# Altium schematic sheet BRK7010.SchDoc: BRK7010
size C; Organization: Opal Kelly; Address1: 13500 SW 72nd Ave, STE 100; Address2: Portland, OR 97223; Address4: http://www.opalkelly.com; DocumentNumber: xxx; Revision: 1; SheetNumber: 1; SheetTotal: 1; PageSetup: Record=PageOptions|CenterHorizontal=True|CenterVertical=True|PrintScale=0.54|XCorrection=1.00|YCorrection=1.00|PrintKind=0|BorderSize=5000000|LeftOffset=0|BottomOffset=0|Orientation=2|PaperLength=1000|PaperWidth=1000|Scale=100|PaperSource=7|PrintQuality=-4|MediaType=1|DitherType=10|PaperKind=Letter|PrintScaleMode=1
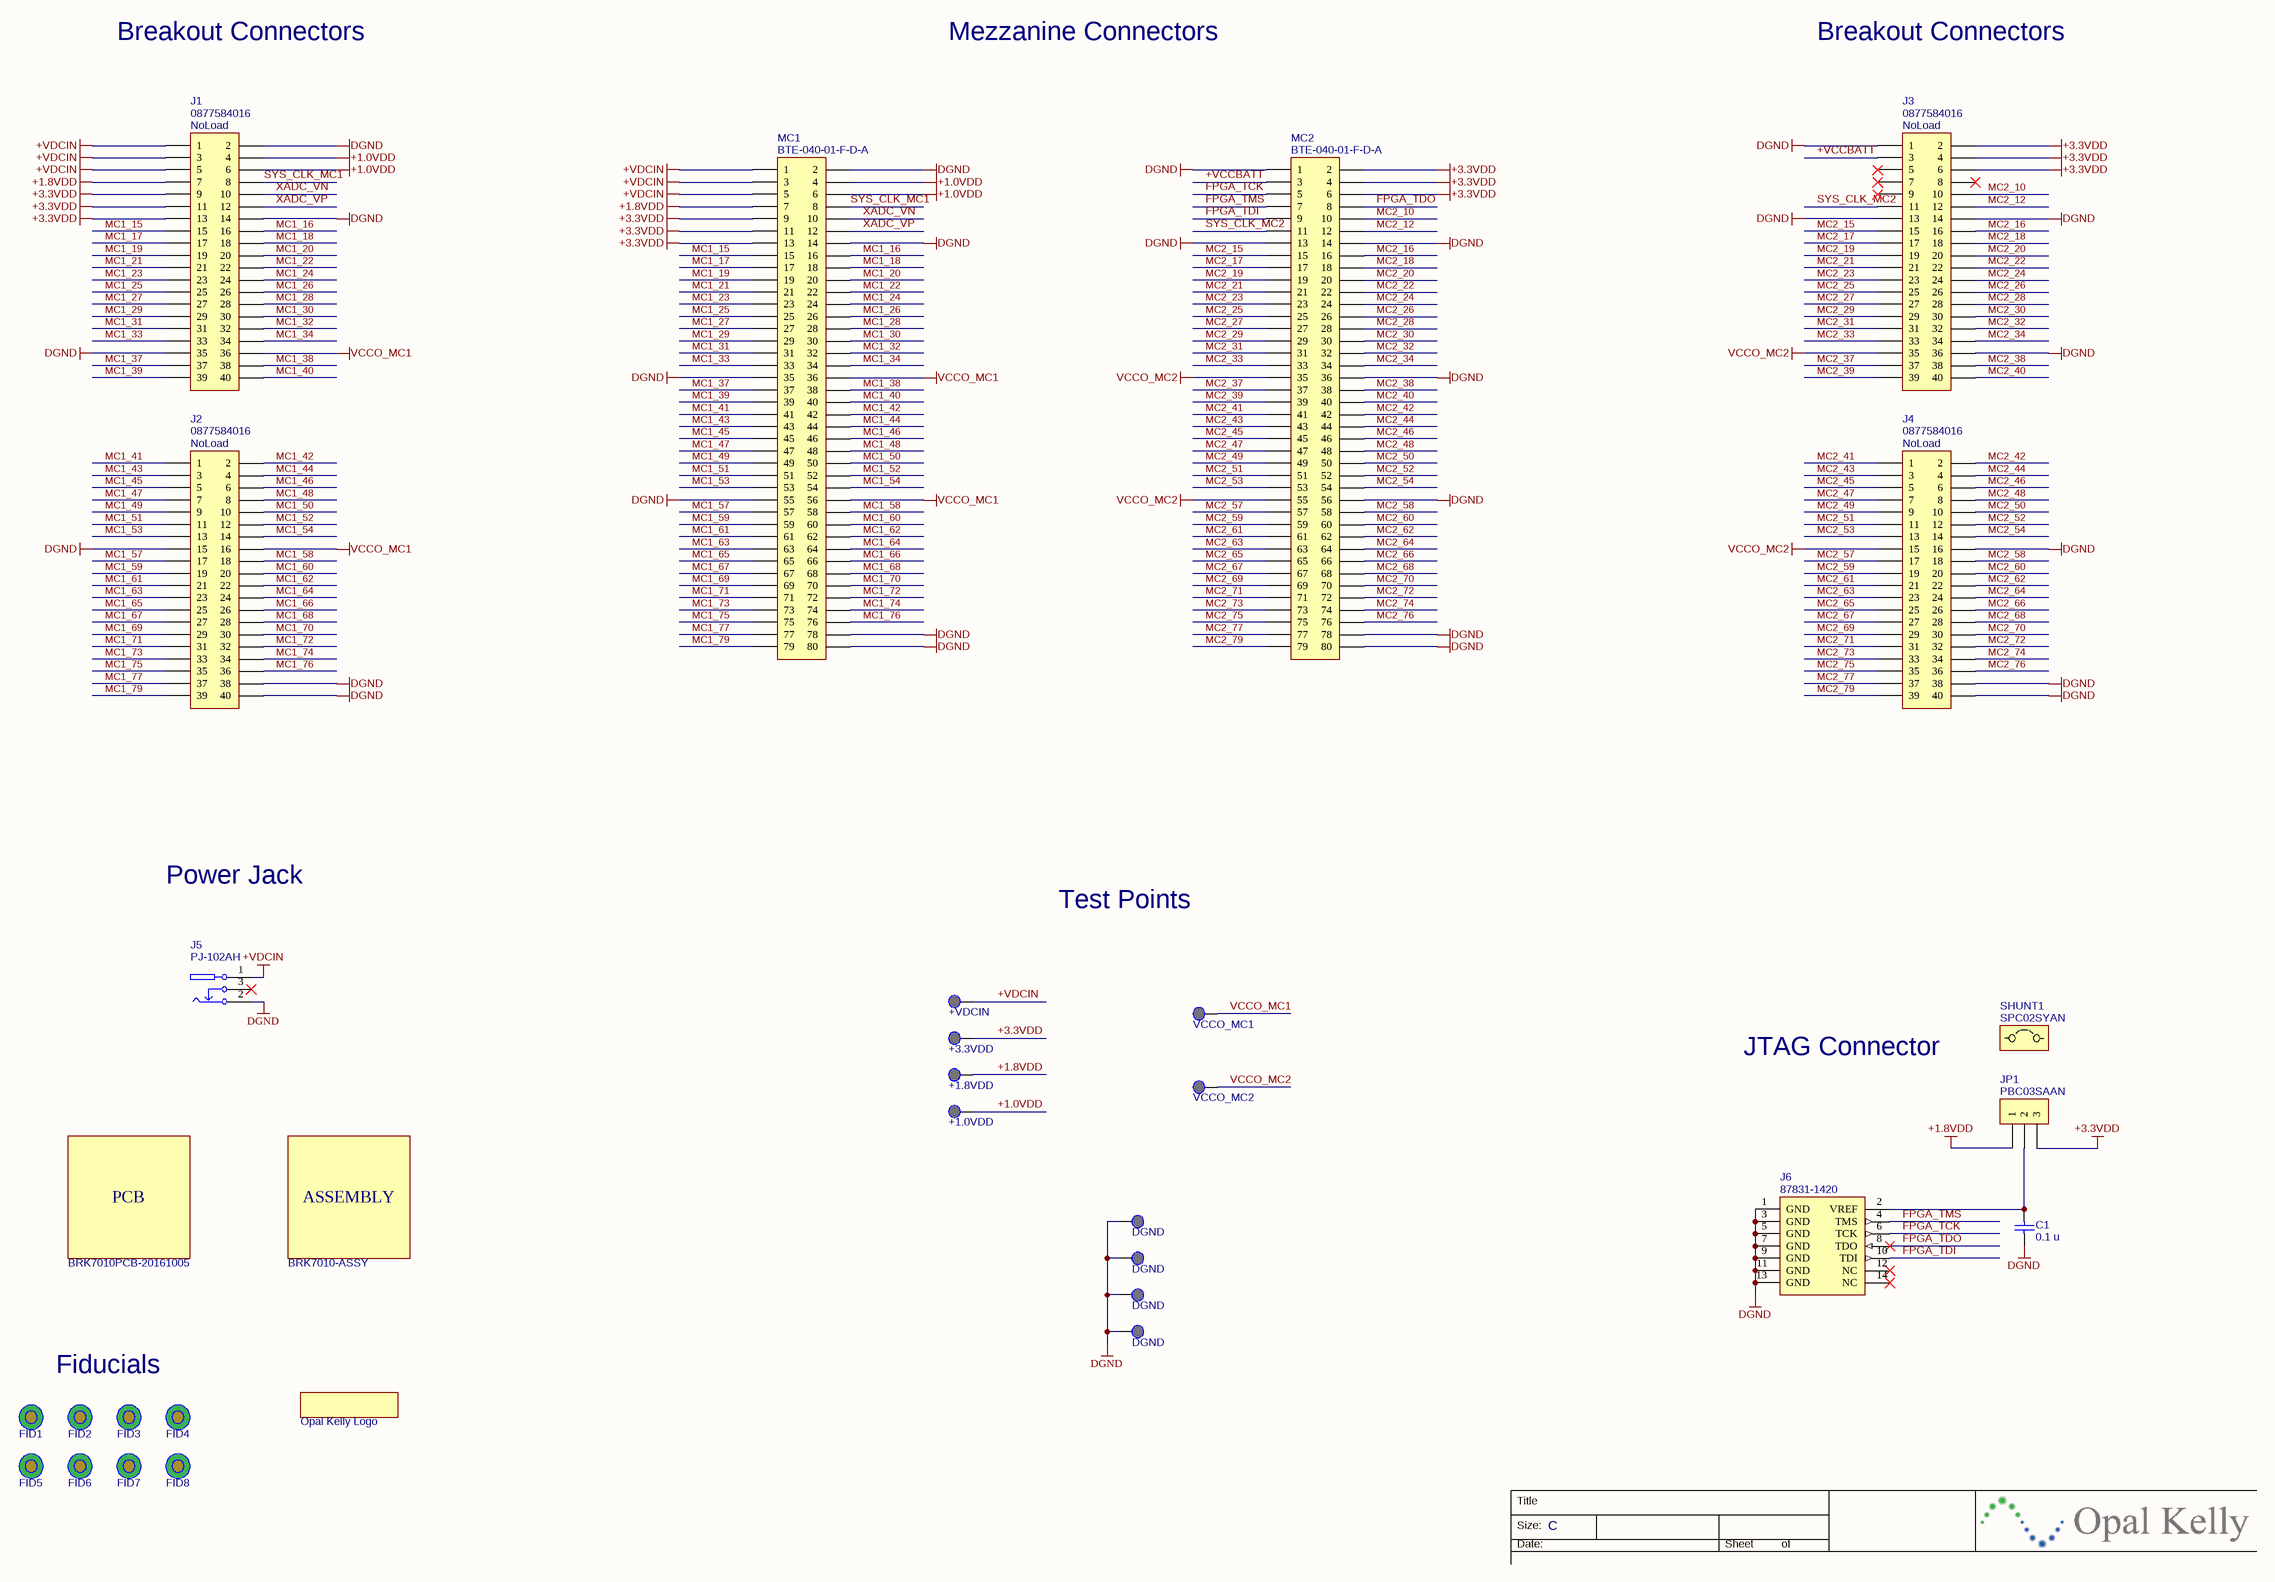
[diagram p0: BRK7010.SchDoc]

## Parts
*1  Opal Kelly Logo  [okLogo-23x5]
ASSY1  BRK7010-ASSY  (mechanical)
C1  value 0.1 u  [CAPC1608N]  (hidden comment: C0603C104K4RACTU)
FID1  FIDUCIAL  [FID1MM/2MM-SS]  (value not drawn)
FID2  FIDUCIAL  [FID1MM/2MM-SS]  (value not drawn)
FID3  FIDUCIAL  [FID1MM/2MM-SS]  (value not drawn)
FID4  FIDUCIAL  [FID1MM/2MM-SS]  (value not drawn)
FID5  FIDUCIAL  [FID1MM/2MM-SS]  (value not drawn)
FID6  FIDUCIAL  [FID1MM/2MM-SS]  (value not drawn)
FID7  FIDUCIAL  [FID1MM/2MM-SS]  (value not drawn)
FID8  FIDUCIAL  [FID1MM/2MM-SS]  (value not drawn)
J1  0877584016  [HDR2X20-2MM]
J2  0877584016  [HDR2X20-2MM]
J3  0877584016  [HDR2X20-2MM]
J4  0877584016  [HDR2X20-2MM]
J5  PJ-102AH  [CUI-PJ102A]
J6  87831-1420  [HDR2X7-2MM]
JP1  PBC03SAAN  [HDR1X3]
MC1  BTE-040-01-F-D-A  [BTE-040]
MC2  BTE-040-01-F-D-A  [BTE-040]
PCB1  BRK7010PCB-20161005  (mechanical)
SHUNT1  SPC02SYAN  (mechanical)
TP1  +VDCIN  [TP-PTH-65/100]
TP2  VCCO_MC1  [TP-PTH-65/100]
TP3  +3.3VDD  [TP-PTH-65/100]
TP4  +1.8VDD  [TP-PTH-65/100]
TP5  VCCO_MC2  [TP-PTH-65/100]
TP6  +1.0VDD  [TP-PTH-65/100]
TP7  DGND  [TP-PTH-65/100]
TP8  DGND  [TP-PTH-65/100]
TP9  DGND  [TP-PTH-65/100]
TP10  DGND  [TP-PTH-65/100]

## Nets
+1.0VDD: J1.4 J1.6 MC1.4 MC1.6 TP6.1(PIN)
+1.8VDD: J1.7 JP1.1 MC1.7 TP4.1(PIN)
+3.3VDD: J1.9 J1.11 J1.13 J3.2 J3.4 J3.6 JP1.3 MC1.9 MC1.11 MC1.13 MC2.2 MC2.4 MC2.6 TP3.1(PIN)
+VDCIN: J1.1 J1.3 J1.5 J5.1 MC1.1 MC1.3 MC1.5 TP1.1(PIN)
DGND: C1.1 J1.2 J1.14 J1.35 J2.15 J2.38 J2.40 J3.1 J3.13 J3.14 J3.36 J4.16 J4.38 J4.40 J5.2 J6.1(GND) J6.3(GND) J6.5(GND) J6.7(GND) J6.9(GND) J6.11(GND) J6.13(GND) MC1.2 MC1.14 MC1.35 MC1.55 MC1.78 MC1.80 MC2.1 MC2.13 MC2.14 MC2.36 MC2.56 MC2.78 MC2.80 TP7.1(PIN) TP8.1(PIN) TP9.1(PIN) TP10.1(PIN)
VCCO_MC1: J1.36 J2.16 MC1.36 MC1.56 TP2.1(PIN)
VCCO_MC2: J3.35 J4.15 MC2.35 MC2.55 TP5.1(PIN)
+VCCBATT: J3.3 MC2.3
FPGA_TCK: J6.6(TCK) MC2.5
FPGA_TDI: J6.10(TDI) MC2.9
FPGA_TDO: J6.8(TDO) MC2.8
FPGA_TMS: J6.4(TMS) MC2.7
MC1_15: J1.15 MC1.15
MC1_16: J1.16 MC1.16
MC1_17: J1.17 MC1.17
MC1_18: J1.18 MC1.18
MC1_19: J1.19 MC1.19
MC1_20: J1.20 MC1.20
MC1_21: J1.21 MC1.21
MC1_22: J1.22 MC1.22
MC1_23: J1.23 MC1.23
MC1_24: J1.24 MC1.24
MC1_25: J1.25 MC1.25
MC1_26: J1.26 MC1.26
MC1_27: J1.27 MC1.27
MC1_28: J1.28 MC1.28
MC1_29: J1.29 MC1.29
MC1_30: J1.30 MC1.30
MC1_31: J1.31 MC1.31
MC1_32: J1.32 MC1.32
MC1_33: J1.33 MC1.33
MC1_34: J1.34 MC1.34
MC1_37: J1.37 MC1.37
MC1_38: J1.38 MC1.38
MC1_39: J1.39 MC1.39
MC1_40: J1.40 MC1.40
MC1_41: J2.1 MC1.41
MC1_42: J2.2 MC1.42
MC1_43: J2.3 MC1.43
MC1_44: J2.4 MC1.44
MC1_45: J2.5 MC1.45
MC1_46: J2.6 MC1.46
MC1_47: J2.7 MC1.47
MC1_48: J2.8 MC1.48
MC1_49: J2.9 MC1.49
MC1_50: J2.10 MC1.50
MC1_51: J2.11 MC1.51
MC1_52: J2.12 MC1.52
MC1_53: J2.13 MC1.53
MC1_54: J2.14 MC1.54
MC1_57: J2.17 MC1.57
MC1_58: J2.18 MC1.58
MC1_59: J2.19 MC1.59
MC1_60: J2.20 MC1.60
MC1_61: J2.21 MC1.61
MC1_62: J2.22 MC1.62
MC1_63: J2.23 MC1.63
MC1_64: J2.24 MC1.64
MC1_65: J2.25 MC1.65
MC1_66: J2.26 MC1.66
MC1_67: J2.27 MC1.67
MC1_68: J2.28 MC1.68
MC1_69: J2.29 MC1.69
MC1_70: J2.30 MC1.70
MC1_71: J2.31 MC1.71
MC1_72: J2.32 MC1.72
MC1_73: J2.33 MC1.73
MC1_74: J2.34 MC1.74
MC1_75: J2.35 MC1.75
MC1_76: J2.36 MC1.76
MC1_77: J2.37 MC1.77
MC1_79: J2.39 MC1.79
MC2_10: J3.10 MC2.10
MC2_12: J3.12 MC2.12
MC2_15: J3.15 MC2.15
MC2_16: J3.16 MC2.16
MC2_17: J3.17 MC2.17
MC2_18: J3.18 MC2.18
MC2_19: J3.19 MC2.19
MC2_20: J3.20 MC2.20
MC2_21: J3.21 MC2.21
MC2_22: J3.22 MC2.22
MC2_23: J3.23 MC2.23
MC2_24: J3.24 MC2.24
MC2_25: J3.25 MC2.25
MC2_26: J3.26 MC2.26
MC2_27: J3.27 MC2.27
MC2_28: J3.28 MC2.28
MC2_29: J3.29 MC2.29
MC2_30: J3.30 MC2.30
MC2_31: J3.31 MC2.31
MC2_32: J3.32 MC2.32
MC2_33: J3.33 MC2.33
MC2_34: J3.34 MC2.34
MC2_37: J3.37 MC2.37
MC2_38: J3.38 MC2.38
MC2_39: J3.39 MC2.39
MC2_40: J3.40 MC2.40
MC2_41: J4.1 MC2.41
MC2_42: J4.2 MC2.42
MC2_43: J4.3 MC2.43
MC2_44: J4.4 MC2.44
MC2_45: J4.5 MC2.45
MC2_46: J4.6 MC2.46
MC2_47: J4.7 MC2.47
MC2_48: J4.8 MC2.48
MC2_49: J4.9 MC2.49
MC2_50: J4.10 MC2.50
MC2_51: J4.11 MC2.51
MC2_52: J4.12 MC2.52
MC2_53: J4.13 MC2.53
MC2_54: J4.14 MC2.54
MC2_57: J4.17 MC2.57
MC2_58: J4.18 MC2.58
MC2_59: J4.19 MC2.59
MC2_60: J4.20 MC2.60
MC2_61: J4.21 MC2.61
MC2_62: J4.22 MC2.62
MC2_63: J4.23 MC2.63
MC2_64: J4.24 MC2.64
MC2_65: J4.25 MC2.65
MC2_66: J4.26 MC2.66
MC2_67: J4.27 MC2.67
MC2_68: J4.28 MC2.68
MC2_69: J4.29 MC2.69
MC2_70: J4.30 MC2.70
MC2_71: J4.31 MC2.71
MC2_72: J4.32 MC2.72
MC2_73: J4.33 MC2.73
MC2_74: J4.34 MC2.74
MC2_75: J4.35 MC2.75
MC2_76: J4.36 MC2.76
MC2_77: J4.37 MC2.77
MC2_79: J4.39 MC2.79
SYS_CLK_MC1: J1.8 MC1.8
SYS_CLK_MC2: J3.11 MC2.11
XADC_VN: J1.10 MC1.10
XADC_VP: J1.12 MC1.12
NetC1_2: C1.2 J6.2(VREF) JP1.2

Not connected (* = marked no-connect by the designer): J3 5* 7* 8* 9*; J5 3*; J6 12(NC)* 14(NC)*

## Notes on the sheet
- Breakout Connectors
- Mezzanine Connectors
- Power Jack
- Test Points
- JTAG Connector
- Fiducials
- Title
- Size:
- Date:
- C
- Sheet
- of

## Library data of the parts
*1 = OKLOGO
ASSY1 = 001451: BRK7010 PCB assembly; Manufacturer: PCB Assembly Cost; partnumber: 001451; Manufacturer_PN: BRK7010-ASSY; updated_on: 10/3/2016 6:18:17 PM
C1 = 000019: Ceramic capacitor; Manufacturer: Kemet; partnumber: 000019; Description 2: SM-0603, 10%, 16v, X7R; ValueFloat: 1E-7; Manufacturer_PN: C0603C104K4RACTU; updated_on: 11/23/2015 9:32:03 AM
FID1-FID8 = FIDUCIAL: PCB fiducial
J1-J4 = 000583: 2mm header, 20x2, thru-hole; Manufacturer: Molex; partnumber: 000583; Manufacturer_PN: 0877584016; updated_on: 1/24/2015 12:30:40 PM; NoLoad: NoLoad
J5 = 000356: DC power connector - high current; Manufacturer: CUI Inc.; partnumber: 000356; Description 2: 2.1mm / 5.5mm; Manufacturer_PN: PJ-102AH; updated_on: 3/10/2016 9:16:59 AM
J6 = 000541: 2mm header, shrouded; Manufacturer: Molex; partnumber: 000541; Description 2: Dual-row, 14-pos, Xilinx JTAG compatible; Manufacturer_PN: 87831-1420; updated_on: 9/27/2016 12:10:17 PM
JP1 = 001173: Single-row header; Manufacturer: Sullins Electronics Corp.; partnumber: 001173; Description 2: Male, 0.1", 3-pos; Manufacturer_PN: PBC03SAAN; updated_on: 1/24/2015 12:32:02 PM
MC1 MC2 = 000059: 0.8mm high-density header; Manufacturer: Samtec; partnumber: 000059; Description 2: 80-pin, Gold flash, Mated height: 5.00mm (0.197 inch); Manufacturer_PN: BTE-040-01-F-D-A; updated_on: 1/18/2016 3:47:24 PM
PCB1 = 001452: PCB for BRK7010; Manufacturer: Generic PCB Manufacturer; partnumber: 001452; x_lifecycle_status: Prototype; Description 2: 20161005; Manufacturer_PN: BRK7010PCB-20161005; updated_on: 10/5/2016 2:50:10 PM
SHUNT1 = 000078: 0.1" shunt; Manufacturer: Sullins Electronics Corp.; partnumber: 000078; Description 2: Gold flash finish; x_lifecycle_status: Production; Manufacturer_PN: SPC02SYAN; updated_on: 7/30/2016 9:01:36 AM
TP1-TP10 = TP-PTH-65/100: Test point, plated through-hole, 65/100mil